# EAGLE design sr_indicator_v0_revB (EAGLE 6.3)
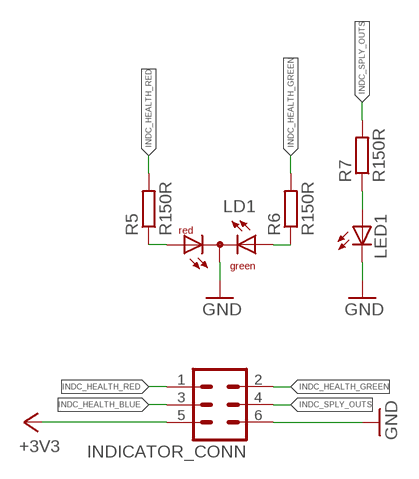
[diagram p0: schematic, sheet 1]

## Parts
INDICATOR_CONN  MA03-2  [MA03-2]
LD1  DUOLED-RG-C  [DUOLED-C-5MM]
LED1  LED5MM  [LED5MM]
R5  R150R  R-EU_M0805  [M0805]
R6  R150R  R-EU_M0805  [M0805]
R7  R150R  R-EU_M0805  [M0805]

## Nets
+3V3: INDICATOR_CONN.5
GND: INDICATOR_CONN.6 LD1.C LED1.K(C)
INDC_HEALTH_BLUE: INDICATOR_CONN.3
INDC_HEALTH_GREEN: INDICATOR_CONN.2 R6.2
INDC_HEALTH_RED: INDICATOR_CONN.1 R5.2
INDC_SPLY_OUTS: INDICATOR_CONN.4 R7.2
N$5: LD1.AR R5.1
N$6: LD1.AX(AG) R6.1
N$7: LED1.A R7.1

## Library data of the parts
INDICATOR_CONN = con-lstb:MA03-2: PIN HEADER; OC_FARNELL: unknown; OC_NEWARK: unknown
LD1 = led:DUOLED-RG-C: DUO LED 2 colors (red/green), 5 mm, round, common Cathode www.ligitek.com or other producers.
LED1 = led:LED: LED OSRAM: - CHIPLED LG R971, LG N971, LY N971, LG Q971, LY Q971, LO R971, LY R971 LH N974, LH R974 LS Q976, LO Q976, LY Q976 LO Q996 - Hyper CHIPLED LW Q18S LB Q993, LB Q99A, LB R99A - SideLED LS A670, LO A670, LY A670, LG A670, LP A670 LB A673, LV A673, LT A673, LW A673 LH A674 LY A675 LS A676, LA A676, LO A676, LY A676, LW A676 LS A679, LY A679, LG A679 - Hyper Micro SIDELED® LS Y876, LA Y876, LO Y876, LY Y876 LT Y87S - SmartLED LW L88C, LW L88S LB L89C, LB L89S, LG L890 LS L89K, LO L89K, LY L89K LS L896, LA L896, LO L896, LY L896 - TOPLED LS T670, LO T670, LY T670, LG T670, LP T670 LSG T670, LSP T670, LSY T670, LOP T670, LYG T670 LG T671, LOG T671, LSG T671 LB T673, LV T673, LT T673, LW T673 LH T674 LS T676, LA T676, LO T676, LY T676, LB T676, LH T676, LSB T676, LW T676 LB T67C, LV T67C, LT T67C, LS T67K, LO T67K, LY T67K, LW E67C LS E67B, LA E67B, LO E67B, LY E67B, LB E67C, LV E67C, LT E67C LW T67C LS T679, LY T679, LG T679 LS T770, LO T770, LY T770, LG T770, LP T770 LB T773, LV T773, LT T773, LW T773 LH T774 LS E675, LA E675, LY E675, LS T675 LS T776, LA T776, LO T776, LY T776, LB T776 LHGB T686 LT T68C, LB T68C - Hyper Mini TOPLED® LB M676 - Mini TOPLED Santana® LG M470 LS M47K, LO M47K, LY M47K Source: http://www.osram.convergy.de LUXEON: - LUMILED® LXK2-PW12-R00, LXK2-PW12-S00, LXK2-PW14-U00, LXK2-PW14-V00 LXK2-PM12-R00, LXK2-PM12-S00, LXK2-PM14-U00 LXK2-PE12-Q00, LXK2-PE12-R00, LXK2-PE12-S00, LXK2-PE14-T00, LXK2-PE14-U00 LXK2-PB12-K00, LXK2-PB12-L00, LXK2-PB12-M00, LXK2-PB14-N00, LXK2-PB14-P00, LXK2-PB14-Q00 LXK2-PR12-L00, LXK2-PR12-M00, LXK2-PR14-Q00, LXK2-PR14-R00 LXK2-PD12-Q00, LXK2-PD12-R00, LXK2-PD12-S00 LXK2-PH12-R00, LXK2-PH12-S00 LXK2-PL12-P00, LXK2-PL12-Q00, LXK2-PL12-R00 Source: www.luxeon.com KINGBRIGHT: KA-3528ASYC Source: www.kingbright.com
R5-R7 = resistor:R-EU_: RESISTOR, European symbol

## Board
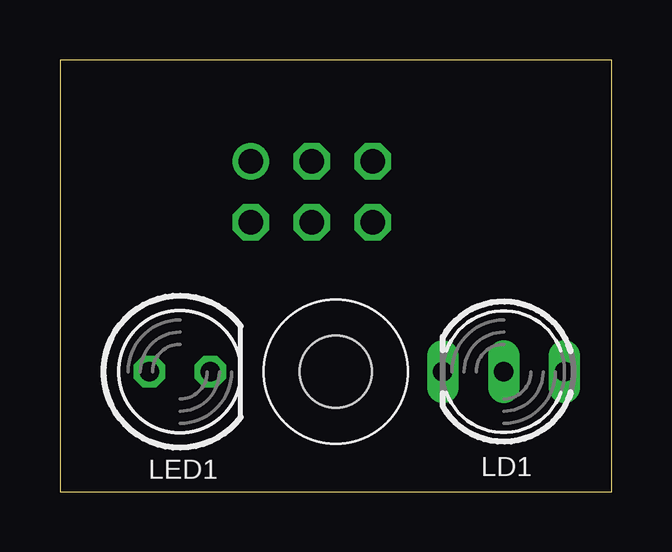
[diagram p1: board, top side]
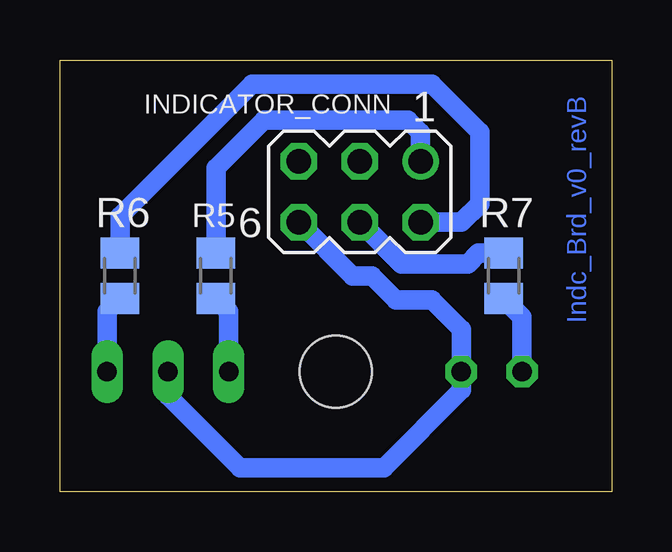
[diagram p2: board, bottom side, seen from below]

Size 23 x 18 mm. Coordinates in mm from the lower left corner, seen from the top.
Outline: 0,0 23,0 23,18 0,18 0,0
Copper layers (1*16): Top 0.035mm / dielectric 1.5mm / Bottom 0.035mm
Design rules "default": minimum track width 10mil, minimum drill 24mil, track to track 8mil, track to pad 8mil, pad to pad 8mil, via to via 8mil, smd to smd 8mil, copper to edge 40mil, drill to drill 8mil, minimum pad ring 10mil, minimum via ring 8mil, stop-mask expansion 4mil, vias tented up to drill 0mil, thermal gap 10mil
Holes 3 mm at 11.5,5

### Footprints (pad centres in the part's own frame; a part is rotated, then mirrored left to right if it is on the bottom)
MA03-2 = drill 1.016: 1 -2.54,-1.27 | drill 1.016 octagon: 2 -2.54,1.27; 3 0,-1.27; 4 0,1.27; 5 2.54,-1.27; 6 2.54,1.27
DUOLED-C-5MM = drill 0.813 long: AR 2.54,0; AX -2.54,0; C 0,0
LED5MM = drill 0.813 octagon: A -1.27,0; K 1.27,0
M0805 = smd 1.3 x 1.6: 1 -0.95,0; 2 0.95,0

### Placement (x,y rotation side)
INDICATOR_CONN  10.5,12.5 180 bottom
LD1  18.5,5 180 top
LED1  5,5 0 top
R5  16.5,9 90 bottom
R6  20.5,9 90 bottom
R7  4.5,9 90 bottom

### Tracks (layer width: path | path; a pad name or v marks a point on that pad's centre or on a via)
GND
  Bottom 0.813: LED1.K 6.27,5.27 | INDICATOR_CONN.6 10.81,9 10,9 9,8 7.5,8 6.27,6.77 LED1.K | LD1.C 18.5,4 15.5,1 9.5,1 6.27,4.23 LED1.K
INDC_HEALTH_GREEN
  Bottom 0.813: R6.2 20.5,11.5 15,17 7.5,17 5.5,15 5.5,12 6.27,11.23 INDICATOR_CONN.2
INDC_HEALTH_RED
  Bottom 0.813: R5.2 16.5,13.5 14.5,15.5 8.5,15.5 7.96,14.96 INDICATOR_CONN.1
INDC_SPLY_OUTS
  Bottom 0.813: R7.2 5.55,9.95 6,9.5 8.77,9.5 INDICATOR_CONN.4
N$5
  Bottom 0.813: LD1.AR 15.96,7.51 R5.1
N$6
  Bottom 0.813: LD1.AX 21.04,7.51 R6.1
N$7
  Bottom 0.813: LED1.A 3.73,7.28 R7.1

### Text on the board
Bottom: Indc_Brd_v0_revB